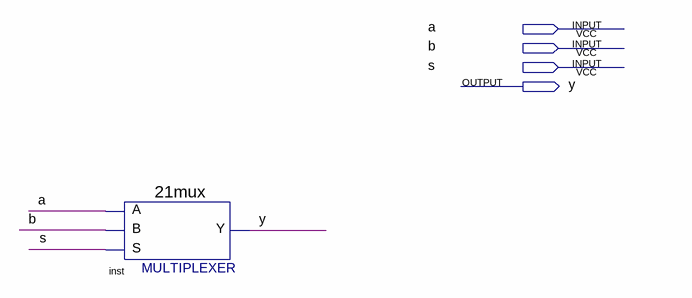
[diagram p0: schematic sheet]
// Quartus schematic Testing.bdf as structural Verilog: 1 symbols, 4 pins
module Testing (
  input  a,
  input  b,
  input  s,
  output y
);

  \21mux  inst (.S(s), .B(b), .A(a), .Y(y));
endmodule
